# Altium schematic sheet Test_Board.SchDoc
size A4; SheetNumber: 1; SheetTotal: 3
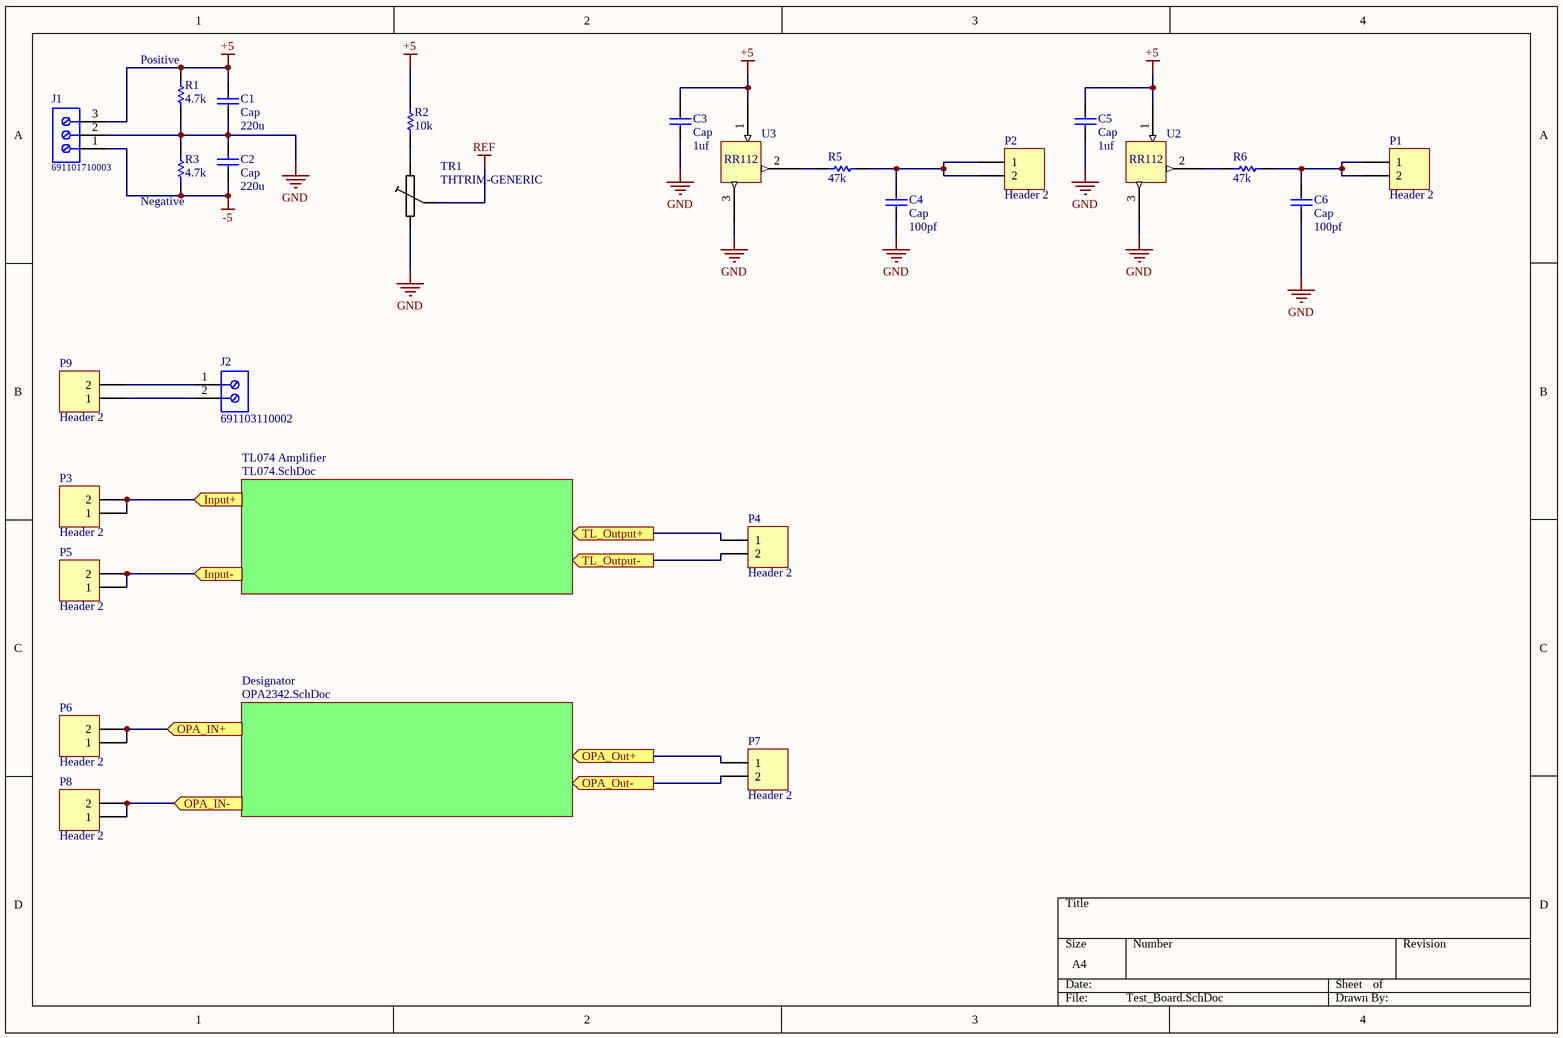
[diagram p0: Test_Board.SchDoc]

## Parts
C1  Cap  value 220u  [RAD-0.3]
C2  Cap  value 220u  [C1206]
C3  Cap  value 1uf  [C1206]
C4  Cap  value 100pf  [C1206]
C5  Cap  value 1uf  [C1206]
C6  Cap  value 100pf  [C1206]
J1  691101710003  [691101710003]
J2  691103110002  [691103110002]
P1  Header 2  [HDR1X2]
P2  Header 2  [HDR1X2]
P3  Header 2  [HDR1X2]
P4  Header 2  [HDR1X2]
P5  Header 2  [HDR1X2]
P6  Header 2  [HDR1X2]
P7  Header 2  [HDR1X2]
P8  Header 2  [HDR1X2]
P9  Header 2  [HDR1X2]
R1  4.7k  [RESC3216X89X51LL25T25]
R2  10k  [RESC3216X89X51LL25T25]
R3  4.7k  [RESC3216X89X51LL25T25]
R5  47k  [RESC3216X89X51LL25T25]
R6  47k  [RESC3216X89X51LL25T25]
TR1  THTRIM-GENERIC  [TRIMMER-MT]
U2  RR112-1G42-531  [SOT145P280X140-3N]  (value not drawn)
U3  RR112-1G42-531  [SOT145P280X140-3N]  (value not drawn)

## Sub-sheets
Designator = OPA2342.SchDoc: no entries
TL074 Amplifier = TL074.SchDoc: no entries

## Ports
Input+ (in), Input- (in), OPA_IN+ (in), OPA_IN- (in), OPA_Out+ (out), OPA_Out- (out), TL_Output+ (out), TL_Output- (out)

## Nets
+5: C1.1 C3.1 C5.1 J1.3 R1.2 R2.2 U2.1(Vdd) U3.1(Vdd)
-5: C2.2 J1.1 R3.1
GND: C1.2 C2.1 C3.2 C4.2 C5.2 C6.2 J1.2 R1.1 R3.2 TR1.1 U2.3(GND) U3.3(GND)
REF: TR1.W
Input+: P3.1 P3.2 ; port Input+
Input-: P5.1 P5.2 ; port Input-
OPA_IN+: P6.1 P6.2 ; port OPA_IN+
OPA_IN-: P8.1 P8.2 ; port OPA_IN-
OPA_Out+: P7.1 ; port OPA_Out+
OPA_Out-: P7.2 ; port OPA_Out-
TL_Output+: P4.1 ; port TL_Output+
TL_Output-: P4.2 ; port TL_Output-
NetC4_1: C4.1 P2.1 P2.2 R5.1
NetC6_1: C6.1 P1.1 P1.2 R6.1
NetJ2_1: J2.1 P9.2
NetJ2_2: J2.2 P9.1
NetR2_1: R2.1 TR1.2
NetR5_2: R5.2 U3.2(Output)
NetR6_2: R6.2 U2.2(Output)

## Notes on the sheet
- (near R1) Positive
- (near R3) Negative
- (in symbol CMP-010-0002465-1) RR112

## Library data of the parts
C1-C6 = Cap: Capacitor; Published: 8-Jun-2000; LatestRevisionDate: 17-Jul-2002; LatestRevisionNote: Re-released for DXP Platform.; PackageReference: RAD-0.3; Publisher: Altium Limited; PackageDescription: Radial Cap, Thru-Hole; 2 Leads; 0.3 in Pin Spacing
J1 = CMP-1502-03257-1: Series 101 - 5.00 mm Horizontal Entry Modular with Pressure Clamp WR-TBL, 3 pin; Manufacturer: Wurth Elektronik; Pitch: 5.00mm; Pin Number: 3; Publisher: WurthElektronik; Part Number: 691101710003; Operating Temperature: -40to105degC; Package Reference: 691101710003; Packaging: Box; Manufacturer URL: http://www.we-online.de; Datasheet URL: http://katalog.we-online.de/em/datasheet/6911017100xx.pdf; Mounting Technology: THT
J2 = CMP-1502-03254-1: Series 1031 - 3.50 mm Horizontal Entry Modular with Pressure Clamp WR-TBL, 2 pin; Manufacturer: Wurth Elektronik; Pin Number: 2; Pitch: 3.50mm; Datasheet URL: http://katalog.we-online.de/em/datasheet/6911031100xx.pdf; Package Reference: 691103110002; Publisher: WurthElektronik; Manufacturer URL: http://www.we-online.de; Mounting Technology: THT; Operating Temperature: -40to105degC; Part Number: 691103110002; Packaging: Box
P1-P9 = Header 2: Header, 2-Pin; LatestRevisionDate: 17-Jul-2002; LatestRevisionNote: Re-released for DXP Platform.; Publisher: Altium Limited
R1-R3 R5 R6 = CMP-2003-04376-1: Part Number: WSLP1206R0500FEA; Manufacturer: Vishay Dale
TR1 = THTRIM-GENERIC: TRIMMABLE RESISTOR
U2 U3 = CMP-010-0002465-1: TMR Sensor